# Altium schematic sheet transceiver module.SchDoc: Transceiver module
size A4; Date: 2011-12-02; Author: Artur Scholz; DocumentNumber: LibreCube LC23-01a
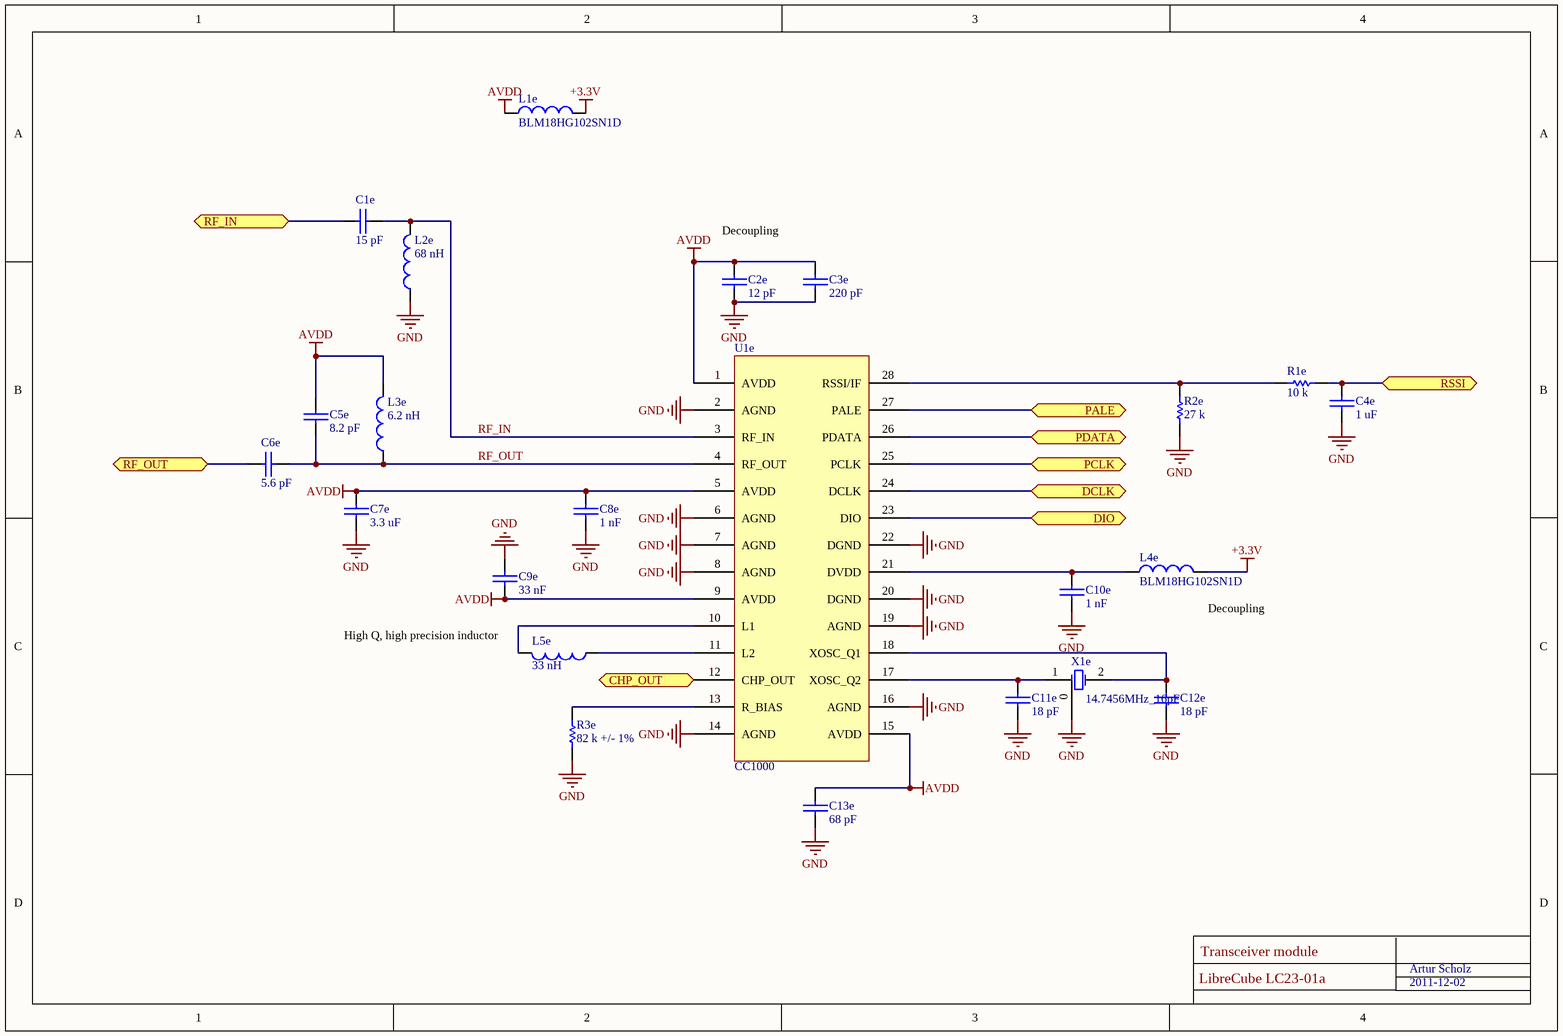
[diagram p0: transceiver module.SchDoc]

## Parts
C1e  15 pF  [0603]
C2e  12 pF  [0603]
C3e  220 pF  [0603]
C4e  1 uF  [0603]
C5e  8.2 pF  [0603]
C6e  5.6 pF  [0603]
C7e  3.3 uF  [0603]
C8e  1 nF  [0603]
C9e  33 nF  [0603]
C10e  1 nF  [0603]
C11e  18 pF  [0603]
C12e  18 pF  [0603]
C13e  68 pF  [0603]
L1e  BLM18HG102SN1D  [0603]
L2e  68 nH  [0603]
L3e  6.2 nH  [0603]
L4e  BLM18HG102SN1D  [0603]
L5e  33 nH  [0603]
R1e  10 k  [0603]
R2e  27 k  [0603]
R3e  82 k +/- 1%  [0603]
U1e  CC1000  [TSSOP-28]
X1e  14.7456MHz_16pF  [XTAL_ABMM2]

## Ports
CHP_OUT, DCLK, DIO, PALE, PCLK, PDATA, RF_IN, RF_OUT, RSSI

## Nets
+3.3V: L1e.2 L4e.2
AVDD: C2e.2 C3e.2 C5e.2 C7e.2 C8e.2 C9e.1 C13e.2 L1e.1 L3e.2 U1e.1(AVDD) U1e.5(AVDD) U1e.9(AVDD) U1e.15(AVDD)
GND: C2e.1 C3e.1 C4e.1 C7e.1 C8e.1 C9e.2 C10e.1 C11e.1 C12e.1 C13e.1 L2e.1 R2e.1 R3e.1 U1e.2(AGND) U1e.6(AGND) U1e.7(AGND) U1e.8(AGND) U1e.14(AGND) U1e.16(AGND) U1e.19(AGND) U1e.20(DGND) U1e.22(DGND) X1e.0
CHP_OUT: U1e.12(CHP_OUT) ; port CHP_OUT
DCLK: U1e.24(DCLK) ; port DCLK
DIO: U1e.23(DIO) ; port DIO
PALE: U1e.27(PALE) ; port PALE
PCLK: U1e.25(PCLK) ; port PCLK
PDATA: U1e.26(PDATA) ; port PDATA
RF_IN: C1e.2 L2e.2 U1e.3(RF_IN)
RF_IN: C1e.1 ; port RF_IN  [a separate net that carries the same name]
RF_OUT: C5e.1 C6e.2 L3e.1 U1e.4(RF_OUT)
RF_OUT: C6e.1 ; port RF_OUT  [a separate net that carries the same name]
RSSI: C4e.2 R1e.1 ; port RSSI
NetC10e_2: C10e.2 L4e.1 U1e.21(DVDD)
NetC11e_2: C11e.2 U1e.17(XOSC_Q2) X1e.1(OSC1)
NetC12e_2: C12e.2 U1e.18(XOSC_Q1) X1e.2(OSC2)
NetL5e_1: L5e.1 U1e.11(L2)
NetL5e_2: L5e.2 U1e.10(L1)
NetR1e_2: R1e.2 R2e.2 U1e.28(RSSI/IF)
NetR3e_2: R3e.2 U1e.13(R_BIAS)

## Notes on the sheet
- Decoupling
- High Q, high precision inductor
- (near L4e) Decoupling

## Library data of the parts
C1e C2e C3e C4e C5e C6e C7e C8e C9e C10e C11e C12e C13e = CAP: Capacitor
L1e L4e = Inductor: Code_IEC: 1005; Value: 33nH; Published: 8-Jun-2000; LatestRevisionDate: 17-Jul-2002; LatestRevisionNote: Re-released for DXP Platform.; PackageReference: 0402-A; Publisher: Altium Limited; Code_JEITA: 0402
L2e = Inductor: Code_IEC: 1005; Value: 68nH; Published: 8-Jun-2000; LatestRevisionDate: 17-Jul-2002; LatestRevisionNote: Re-released for DXP Platform.; PackageReference: 0402-A; Publisher: Altium Limited; Code_JEITA: 0402
L3e = Inductor: Code_IEC: 1005; Value: 6.2nH; Published: 8-Jun-2000; LatestRevisionDate: 17-Jul-2002; LatestRevisionNote: Re-released for DXP Platform.; PackageReference: 0402-A; Publisher: Altium Limited; Code_JEITA: 0402
L5e = Inductor: Inductor LQW18AN27NJ00D; Code_IEC: 1005; Value: 33nH; Published: 8-Jun-2000; LatestRevisionDate: 17-Jul-2002; LatestRevisionNote: Re-released for DXP Platform.; PackageReference: 0402-A; Publisher: Altium Limited; Code_JEITA: 0402
R1e R2e = Res1: Resistor; Value: 27K; Published: 8-Jun-2000; LatestRevisionDate: 17-Jul-2002; LatestRevisionNote: Re-released for DXP Platform.; PackageReference: AXIAL-0.3; Publisher: Altium Limited
R3e = Res1: Resistor; Value: 82K; Published: 8-Jun-2000; LatestRevisionDate: 17-Jul-2002; LatestRevisionNote: Re-released for DXP Platform.; PackageReference: AXIAL-0.3; Publisher: Altium Limited
X1e = XTAL: Crystal Oscillator; Published: 8-Jun-2000; LatestRevisionDate: 17-Jul-2002; LatestRevisionNote: Re-released for DXP Platform.; PackageReference: R38; Publisher: Altium Limited